# EAGLE design AgnusAdaptor (EAGLE 9.6.2)
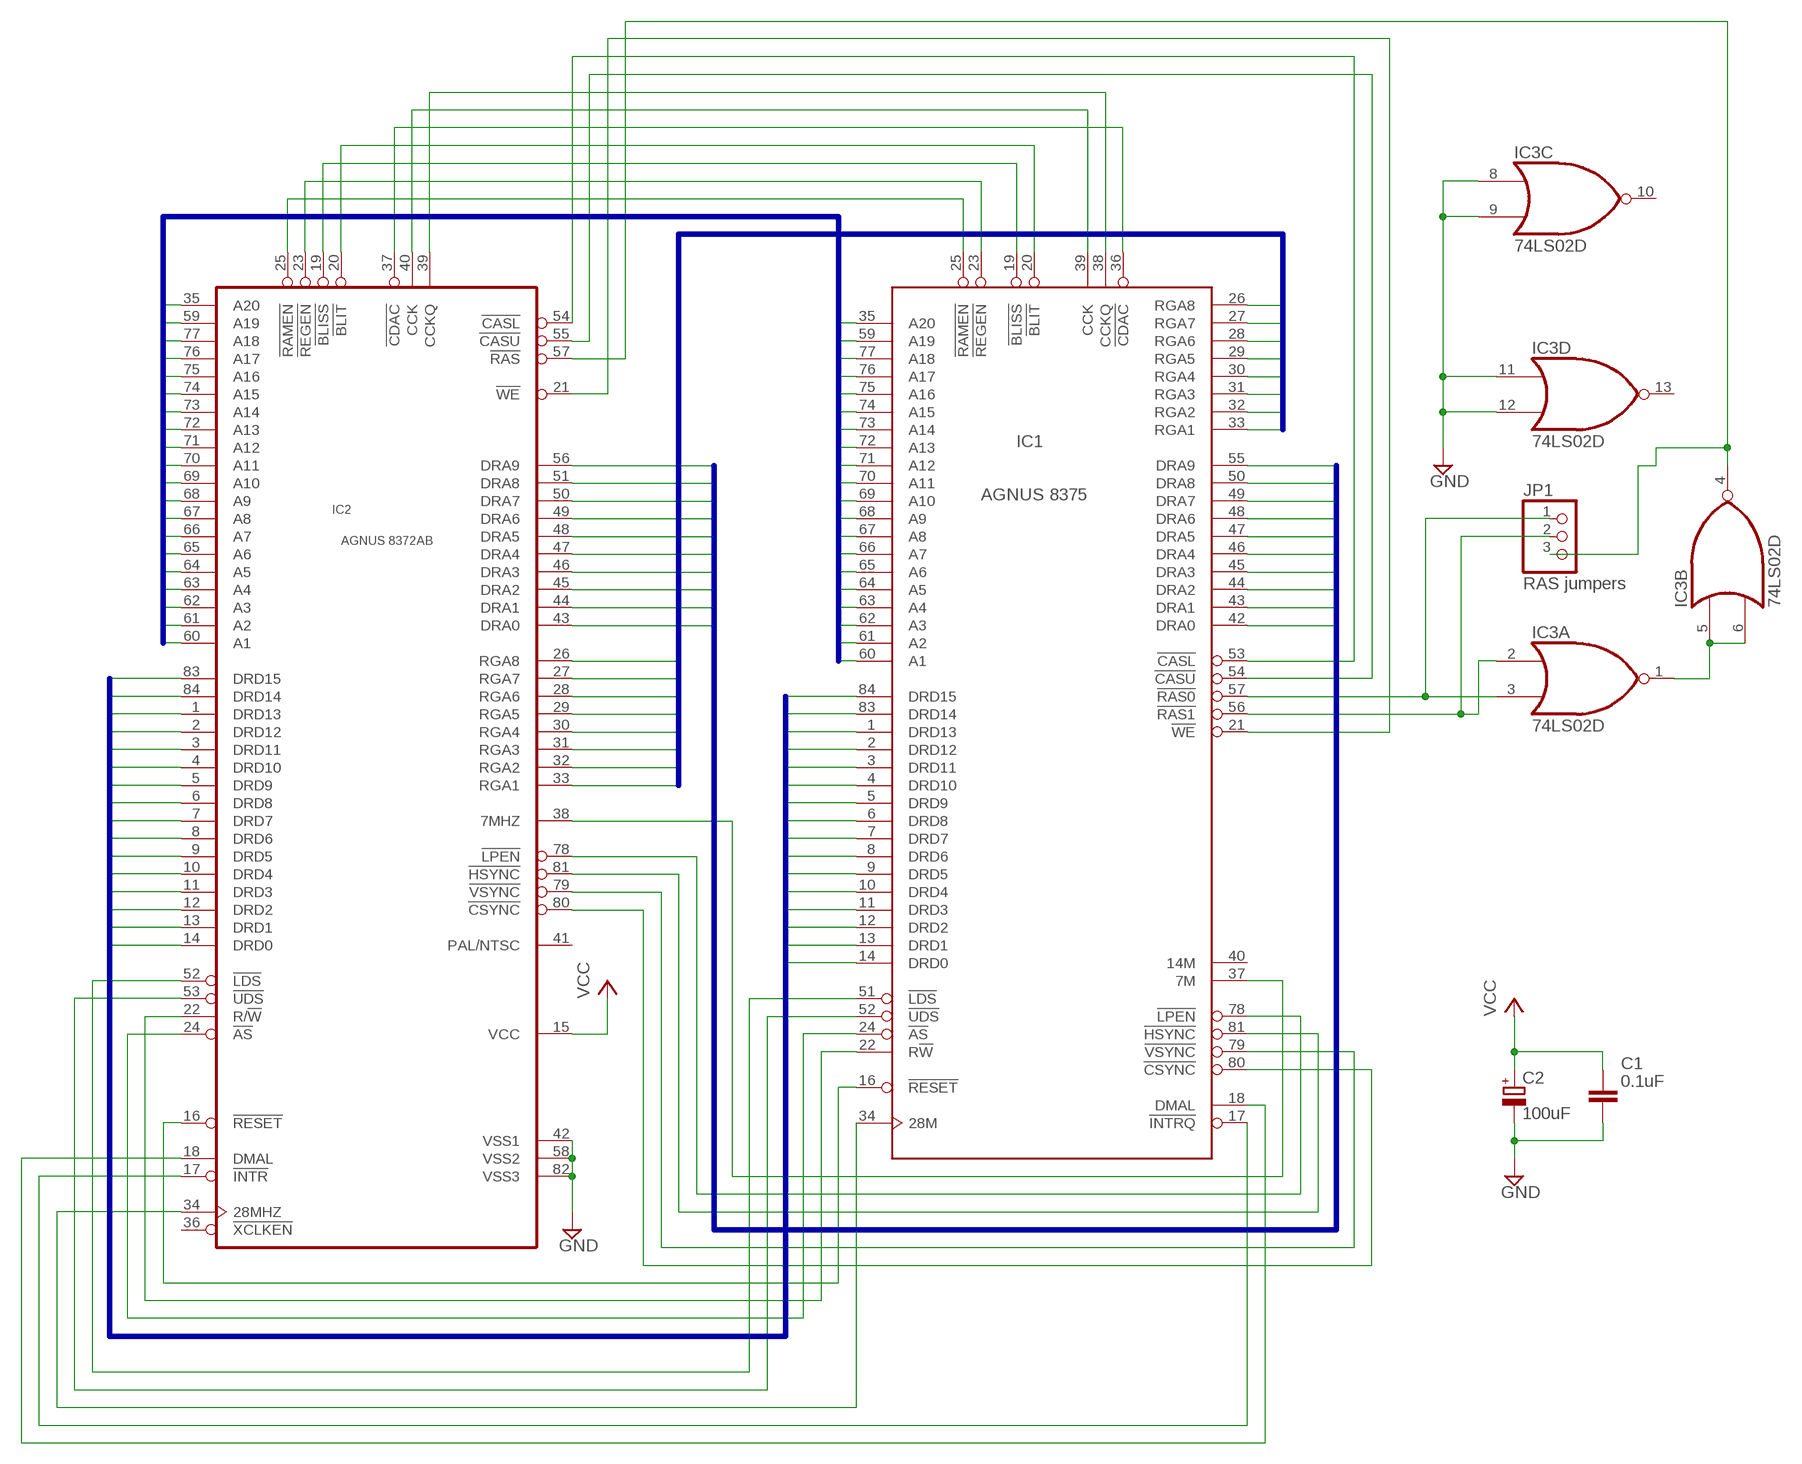
[diagram p0: schematic, sheet 1]

## Parts
C1  0.1uF  C_CHIP-0805(2012-METRIC)  [CAPC2012X110]
C2  100uF  C-POL_ECAP-8.5MM  [CAPAE830X1050N]
IC1  AGNUS_8375_A500+_A600_THT  [PLCC84_T]
IC2  A3000 Agnus Socket  AGNUS_8372AB_THT  [PLCC84_T]
IC3  74LS02D  [SO14]
JP1  RAS jumpers  PINHD-1X3  [1X03]

## Nets
7MHZ: IC1.37(7M) IC2.38(7MHZ)
28MHZ: IC1.34(28M) IC2.34(28MHZ)
!AS: IC1.24(!AS) IC2.24(!AS)
!BLISS: IC1.19(!BLISS) IC2.19(!BLISS)
!BLIT: IC1.20(!BLIT) IC2.20(!BLIT)
!CASL: IC1.53(!CASL) IC2.54(!CASL)
!CASU: IC1.54(!CASU) IC2.55(!CASU)
!CDAC: IC1.36(!CDAC) IC2.37(!CDAC)
!CSYNC: IC1.80(!CSYNC) IC2.80(!CSYNC)
!HSYNC: IC1.81(!HSYNC) IC2.81(!HSYNC)
!INTRQ: IC1.17(!INTRQ) IC2.17(!INTR)
!LDS: IC1.51(!LDS) IC2.52(!LDS)
!LPEN: IC1.78(!LPEN) IC2.78(!LPEN)
!RAMEN: IC1.25(!RAMEN) IC2.25(!RAMEN)
!RAS: IC2.57(!RAS) IC3.4(B:O) JP1.3
!RAS0: IC1.57(!RAS0) IC3.3(A:I1) JP1.1
!RAS1: IC1.56(!RAS1) IC3.2(A:I0) JP1.2
!REGEN: IC1.23(!REGEN) IC2.23(!REGEN)
!RESET: IC1.16(!RESET) IC2.16(!RESET)
!UDS: IC1.52(!UDS) IC2.53(!UDS)
!VSYNC: IC1.79(!VSYNC) IC2.79(!VSYNC)
!WE: IC1.21(!WE) IC2.21(!WE)
A1: IC1.60(A1) IC2.60(A1)
A2: IC1.61(A2) IC2.61(A2)
A3: IC1.62(A3) IC2.62(A3)
A4: IC1.63(A4) IC2.63(A4)
A5: IC1.64(A5) IC2.64(A5)
A6: IC1.65(A6) IC2.65(A6)
A7: IC1.66(A7) IC2.66(A7)
A8: IC1.67(A8) IC2.67(A8)
A9: IC1.68(A9) IC2.68(A9)
A10: IC1.69(A10) IC2.69(A10)
A11: IC1.70(A11) IC2.70(A11)
A12: IC1.71(A12) IC2.71(A12)
A13: IC1.72(A13) IC2.72(A13)
A14: IC1.73(A14) IC2.73(A14)
A15: IC1.74(A15) IC2.74(A15)
A16: IC1.75(A16) IC2.75(A16)
A17: IC1.76(A17) IC2.76(A17)
A18: IC1.77(A18) IC2.77(A18)
A19: IC1.59(A19) IC2.59(A19)
A20: IC1.35(A20) IC2.35(A20)
CCK: IC1.39(CCK) IC2.40(CCK)
CCKQ: IC1.38(CCKQ) IC2.39(CCKQ)
DMAL: IC1.18(DMAL) IC2.18(DMAL)
DRA0: IC1.42(DRA0) IC2.43(DRA0)
DRA1: IC1.43(DRA1) IC2.44(DRA1)
DRA2: IC1.44(DRA2) IC2.45(DRA2)
DRA3: IC1.45(DRA3) IC2.46(DRA3)
DRA4: IC1.46(DRA4) IC2.47(DRA4)
DRA5: IC1.47(DRA5) IC2.48(DRA5)
DRA6: IC1.48(DRA6) IC2.49(DRA6)
DRA7: IC1.49(DRA7) IC2.50(DRA7)
DRA8: IC1.50(DRA8) IC2.51(DRA8)
DRA9: IC1.55(DRA9) IC2.56(DRA9)
DRD0: IC1.14(DRD0) IC2.14(DRD0)
DRD1: IC1.13(DRD1) IC2.13(DRD1)
DRD2: IC1.12(DRD2) IC2.12(DRD2)
DRD3: IC1.11(DRD3) IC2.11(DRD3)
DRD4: IC1.10(DRD4) IC2.10(DRD4)
DRD5: IC1.9(DRD5) IC2.9(DRD5)
DRD6: IC1.8(DRD6) IC2.8(DRD6)
DRD7: IC1.7(DRD7) IC2.7(DRD7)
DRD8: IC1.6(DRD8) IC2.6(DRD8)
DRD9: IC1.5(DRD9) IC2.5(DRD9)
DRD10: IC1.4(DRD10) IC2.4(DRD10)
DRD11: IC1.3(DRD11) IC2.3(DRD11)
DRD12: IC1.2(DRD12) IC2.2(DRD12)
DRD13: IC1.1(DRD13) IC2.1(DRD13)
DRD14: IC1.83(DRD14) IC2.84(DRD14)
DRD15: IC1.84(DRD15) IC2.83(DRD15)
GND: C1.2 C2.2(-) IC2.42(VSS1) IC2.58(VSS2) IC2.82(VSS3) IC3.8(C:I0) IC3.9(C:I1) IC3.11(D:I0) IC3.12(D:I1)
R!W: IC1.22(R!W) IC2.22(R/!W!)
RAS: IC3.1(A:O) IC3.5(B:I0) IC3.6(B:I1)
RGA1: IC1.33(RGA1) IC2.33(RGA1)
RGA2: IC1.32(RGA2) IC2.32(RGA2)
RGA3: IC1.31(RGA3) IC2.31(RGA3)
RGA4: IC1.30(RGA4) IC2.30(RGA4)
RGA5: IC1.29(RGA5) IC2.29(RGA5)
RGA6: IC1.28(RGA6) IC2.28(RGA6)
RGA7: IC1.27(RGA7) IC2.27(RGA7)
RGA8: IC1.26(RGA8) IC2.26(RGA8)
VCC [Vcc]: C1.1 C2.1(+) IC2.15(VCC)
Unconnected: IC1.40(14M) IC2.36(!XCLKEN) IC2.41(PAL/NTSC) IC3.10(C:O) IC3.13(D:O)

## Buses
A[1..20]
DRD[0..15]
RGA[1..8]
DRA[0..9]

## Power pins joined to a net without a drawn wire
GND: IC1.41(GND) IC1.58(GND) IC1.82(GND) IC3.7(P:GND)
VCC: IC1.15(VCC) IC3.14(P:VCC)

## Library data of the parts
C1 = Capacitor:C: Capacitor - Generic; CATEGORY: Capacitor
C2 = Capacitor:C-POL: Capacitor Polarised - Generic; CATEGORY: Capacitor
IC1 = Amiga:AGNUS_8375_A500+_A600: 8375-(390344-0X)-AGNUS for A500+ and A600
IC2 = Amiga:AGNUS_8372AB: 8372AB AGNUS (318069-03x) for A3000(T)
IC3 = 74xx-us:74*02: Quad 2-input NOR gate
JP1 = pinhead:PINHD-1X3: PIN HEADER

## Net classes
1 Vcc: width 0.406 mm

## Board
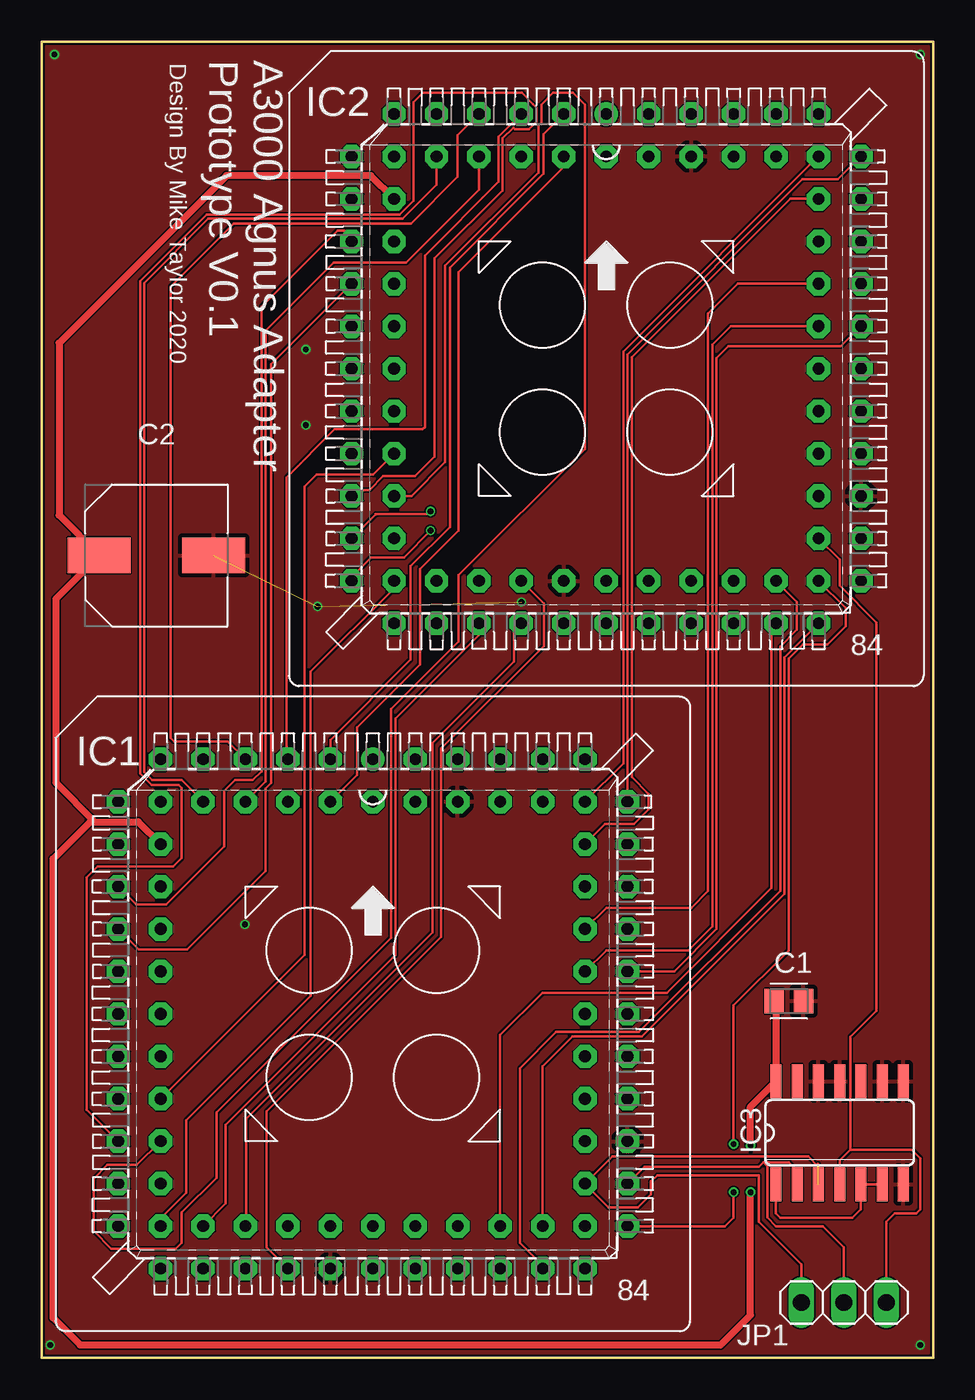
[diagram p1: board, top side]
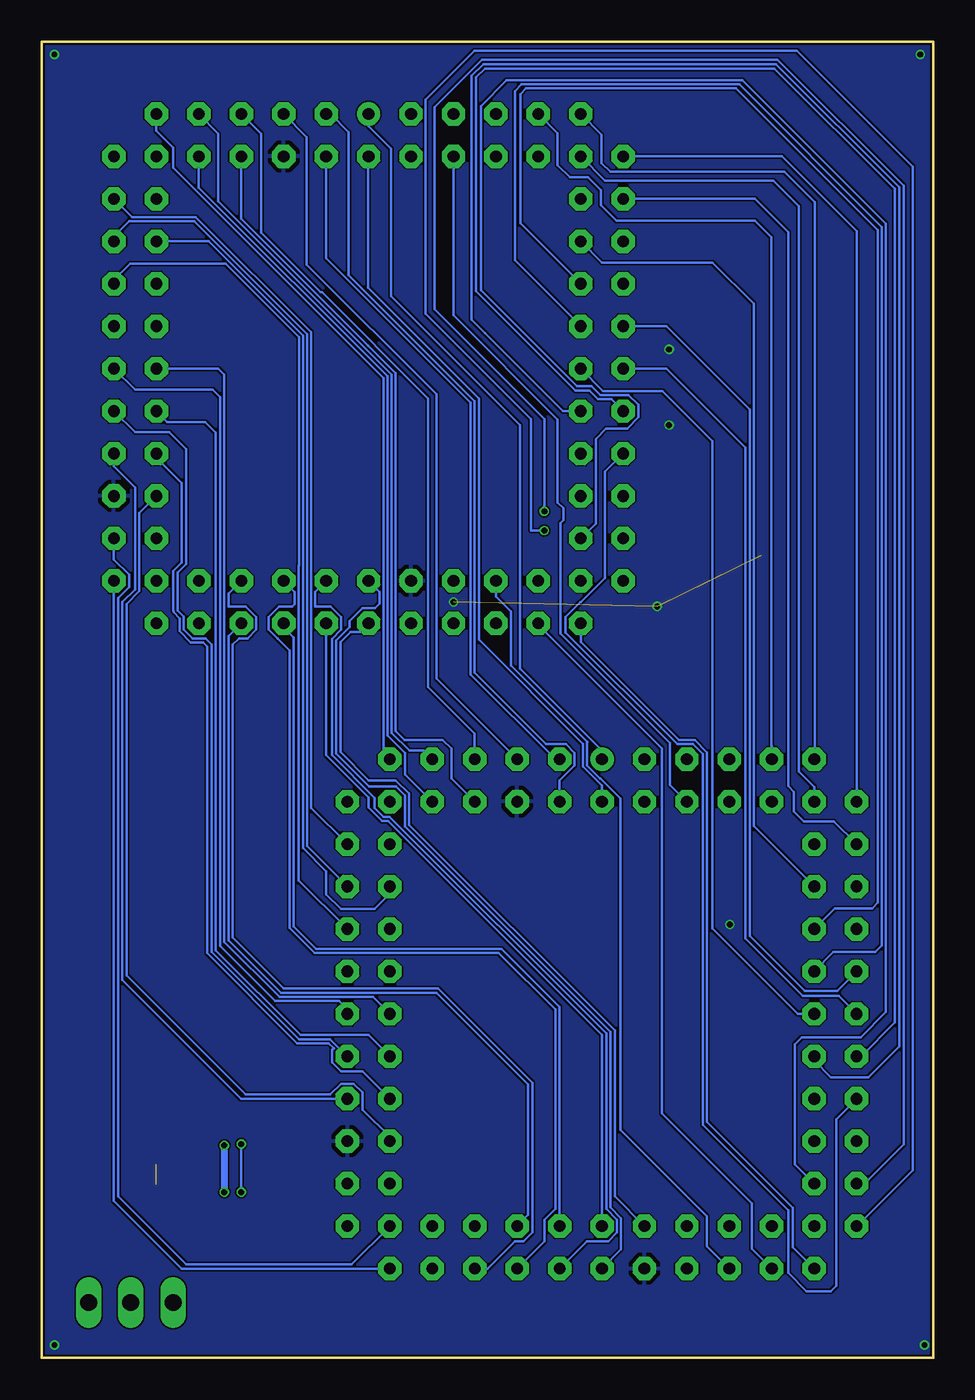
[diagram p2: board, bottom side, seen from below]

Size 53.34 x 78.74 mm. Coordinates in mm from the lower left corner, seen from the top.
Outline: 0,78.74 53.34,78.74 53.34,0 0,0 0,78.74
Copper layers (1*16): Top 0.035mm / dielectric 0.2mm / Bottom 0.035mm
Design rules "jlcpcb-2-layer *": minimum track width 3.5mil, minimum drill 0.2mm, track to track 3.5mil, track to pad 5mil, pad to pad 5mil, via to via 5mil, smd to smd 0mil, copper to edge 0.1mm, drill to drill 5mil, minimum pad ring 4mil, minimum via ring 4mil, stop-mask expansion 3mil, vias tented up to drill 100mil, thermal gap 10mil

### Footprints (pad centres in the part's own frame; a part is rotated, then mirrored left to right if it is on the bottom)
CAPC2012X110 = smd 1.165 x 1.465: 1 -0.875,0; 2 0.875,0
CAPAE830X1050N = smd 3.764 x 2.115: 1 -3.426,0; 2 3.426,0
PLCC84_T = drill 0.7 pad 1.4: 1 0,15.24 | drill 0.7 pad 1.4 octagon: 2 0,12.7; 3 -2.54,15.24; 4 -2.54,12.7; 5 -5.08,15.24; 6 -5.08,12.7; 7 -7.62,15.24; 8 -7.62,12.7; 9 -10.16,15.24; 10 -10.16,12.7; 11 -12.7,15.24; 12 -15.24,12.7; 13 -12.7,12.7; 14 -15.24,10.16; 15 -12.7,10.16; 16 -15.24,7.62; 17 -12.7,7.62; 18 -15.24,5.08; 19 -12.7,5.08; 20 -15.24,2.54; 21 -12.7,2.54; 22 -15.24,0; 23 -12.7,0; 24 -15.24,-2.54; 25 -12.7,-2.54; 26 -15.24,-5.08; 27 -12.7,-5.08; 28 -15.24,-7.62; 29 -12.7,-7.62; 30 -15.24,-10.16; 31 -12.7,-10.16; 32 -15.24,-12.7; 33 -12.7,-15.24; 34 -12.7,-12.7; 35 -10.16,-15.24; 36 -10.16,-12.7; 37 -7.62,-15.24; 38 -7.62,-12.7; 39 -5.08,-15.24; 40 -5.08,-12.7; 41 -2.54,-15.24; 42 -2.54,-12.7; 43 0,-15.24; 44 0,-12.7; 45 2.54,-15.24; 46 2.54,-12.7; 47 5.08,-15.24; 48 5.08,-12.7; 49 7.62,-15.24; 50 7.62,-12.7; 51 10.16,-15.24; 52 10.16,-12.7; 53 12.7,-15.24; 54 15.24,-12.7; 55 12.7,-12.7; 56 15.24,-10.16; 57 12.7,-10.16; 58 15.24,-7.62; 59 12.7,-7.62; 60 15.24,-5.08; 61 12.7,-5.08; 62 15.24,-2.54; 63 12.7,-2.54; 64 15.24,0; 65 12.7,0; 66 15.24,2.54; 67 12.7,2.54; 68 15.24,5.08; 69 12.7,5.08; 70 15.24,7.62; 71 12.7,7.62; 72 15.24,10.16; 73 12.7,10.16; 74 15.24,12.7; 75 12.7,15.24; 76 12.7,12.7; 77 10.16,15.24; 78 10.16,12.7; 79 7.62,15.24; 80 7.62,12.7; 81 5.08,15.24; 82 5.08,12.7; 83 2.54,15.24; 84 2.54,12.7
SO14 = smd 0.66 x 2.032: 1 -3.81,-3.073; 2 -2.54,-3.073; 3 -1.27,-3.073; 4 0,-3.073; 5 1.27,-3.073; 6 2.54,-3.073; 7 3.81,-3.073; 8 3.81,3.073; 9 2.54,3.073; 10 1.27,3.073; 11 0,3.073; 12 -1.27,3.073; 13 -2.54,3.073; 14 -3.81,3.073
1X03 = drill 1.016 long: 1 -2.54,0; 2 0,0; 3 2.54,0

### Placement (x,y rotation side)
C1  44.7,21.34 0 top
C2  6.86,48.01 0 top
IC1  19.81,20.57 0 top
IC2  33.78,59.18 0 top
IC3  47.75,13.46 0 top
JP1  48.01,3.3 0 top

### Tracks (layer width: path | path; a pad name or v marks a point on that pad's centre or on a via)
7MHZ
  Bottom 0.152: IC2.38 26.16,45.54 25.27,44.65 25.27,41.41 20.69,36.83 20.71,36.81 20.71,35.44 19.93,34.66 19.9,34.66 18.72,33.48 18.72,13.64 13.54,8.46 13.54,6.68 IC1.37
28MHZ
  Top 0.152: IC2.34 21.08,46.04 16.09,41.05 16.09,21.64 8.65,14.2 8.65,9.87 7.11,8.33 IC1.34
!AS
  Bottom 0.15: IC2.24 19.25,57.35 20.05,57.35 20.57,57.88 21.41,57.88 27.36,63.83 27.36,76.61 26.82,77.14 9.49,77.14 2.29,69.94 2.29,20.05 4.3,18.03 IC1.24
!BLISS
  Bottom 0.152: IC2.19 24.7,67.88 24.7,75.6 24.35,75.95 11.79,75.95 3.31,67.47 3.31,27.23 3.65,26.9 5.87,26.9 IC1.19
!BLIT
  Bottom 0.152: IC2.20 15.96,61.72 10.97,56.73 10.97,25.25 7.66,21.94 5.74,21.94 IC1.20
!CASL
  Bottom 0.152: IC2.54 49.02,9.4 44.96,5.33 IC1.53
!CASU  (via drill 0.35)
  Top 0.152: IC2.55 48.12,44.84 48.12,43.77 47.02,42.67 45.55,42.67 44.7,41.82 44.7,24.38 41.4,21.08 v41.4,12.79 41.4,12.7 | v41.4,9.91 41.4,8.38 40.89,7.87 IC1.54
  Bottom 0.152: v41.4,12.79 v41.4,9.91
!CDAC
  Top 0.152: IC2.37 26.16,43.23 21.18,38.25 21.18,24.1 11.01,13.93 11.01,9.23 IC1.36
!CSYNC
  Bottom 0.152: IC1.80 28.82,34.66 28.82,36.44 29.34,36.97 31.64,36.97 32.15,37.49 32.15,58.91 33.81,60.57 41.4,68.17 IC2.80
!HSYNC
  Bottom 0.152: IC1.81 29.72,40.64 29.72,57.66 37.48,65.42 37.48,73.04 IC2.81
!INTRQ
  Bottom 0.152: IC2.17 19.81,65.53 13.2,65.53 10.73,63.06 10.73,31.81 IC1.17
!LDS
  Top 0.152: IC2.52 45.2,45.22 45.2,43.57 44.2,42.56 44.2,27.94 35.74,19.48 30.79,19.48 28.62,17.32 28.62,6.88 29.97,5.53 IC1.51
!LPEN
  Bottom 0.152: IC2.78 43.94,70.03 32.64,58.72 32.64,37.22 31.61,36.19 31.61,34.91 IC1.78
!RAMEN
  Bottom 0.15: 27.62,62.12 27.62,76.7 26.91,77.41 9.4,77.41 2.02,70.03 2.02,18.64 3.89,16.78 6.11,16.78 7.11,17.78 IC1.25
  Bottom 0.152: 27.62,62.12 26.82,61.32 22.15,56.64 IC2.25
!RAS
  Top 0.152: 47.75,11.07 IC3.4 47.75,11.81 48.39,12.45 | 48.39,12.45 48.39,19.21 49.95,20.77 49.95,44 47.75,46.19 47.75,47.75 IC2.57 | JP1.3 50.55,8.13 51.05,8.64 52.32,8.64 52.58,8.89 52.58,11.94 52.07,12.45 48.39,12.45
!RAS0  (1 unrouted)
  Top 0.152: 46.48,11.58 46.46,11.61 | IC3.3 46.48,11.43 45.86,12.05 34.15,12.05 IC1.57 33.92,9 35.68,9 36.46,9.79 36.46,10.55 36.83,10.92 42.93,10.92 42.93,8.13 45.47,5.59 JP1.1
!RAS1
  Top 0.152: IC3.2 45.47,10.64 45.47,10.92 44.7,11.68 43.18,11.68 | JP1.2 48.01,6.6 46.74,7.87 43.94,7.87 43.41,8.41 43.41,11.45 43.18,11.68 | IC1.56 36.07,11.43 42.93,11.43 43.18,11.68
!REGEN
  Bottom 0.152: IC2.23 19.75,57.85 16.19,57.85 13.2,54.85 13.2,25.68 8.09,20.57 IC1.23
!RESET
  Top 0.15: 10.92,33.9 11.58,34.56 12.62,34.56 13.15,35.09
  Top 0.152: 13.15,35.09 13.15,62.89 17.71,67.45 18.11,67.45 18.54,67.02 IC2.16 | 10.92,33.9 10.92,30.6 7.45,27.13 5.64,27.13 IC1.16
!UDS
  Top 0.152: IC2.53 44.44,41.9 44.44,27.76 35.9,19.23 31.76,19.23 29.97,17.44 IC1.52
!VSYNC
  Bottom 0.152: IC2.79 40.21,73.23 40.21,67.31 36.65,63.75 36.58,63.75 30.23,57.4 30.23,40.13 27.43,37.34 IC1.79
!WE
  Bottom 0.152: IC2.21 25.03,65.67 25.03,75.78 24.63,76.19 11.6,76.19 3.07,67.66 3.07,24.67 3.47,24.27 5.96,24.27 IC1.21
A1
  Bottom 0.152: IC2.60 49.02,53.34 47.75,52.07 47.75,45.97 48.51,45.21 48.51,22.61 41.4,15.49 IC1.60
A2
  Bottom 0.152: 37.34,18.8 37.36,18.82 | 37.36,18.82 38.05,18.82 43.43,24.21 43.43,42.54 43.69,42.8 44.42,42.8 45.09,43.47 45.09,44.24 45.45,44.6 45.45,44.69 45.47,44.7 45.47,47.08 44.96,47.59 44.96,52.32 46.48,53.85 IC2.61 | 37.36,18.82 36.18,18.82 35.86,18.5 35.95,18.41 35.95,17.66 35.43,17.13 34.15,17.13 IC1.61
A3
  Bottom 0.152: IC2.62 47.75,55.37 45.72,55.37 44.7,54.36 44.7,47.5 45.21,46.99 45.21,44.7 44.84,44.34 44.84,43.57 44.32,43.04 43.55,43.04 43.18,42.67 43.18,24.3 37.95,19.06 36.08,19.06 IC1.62
A4
  Bottom 0.152: IC1.63 33.78,19.3 37.85,19.3 42.93,24.38 42.93,55.36 43.55,55.98 45.82,55.98 IC2.63
A5
  Bottom 0.152: IC2.64 47.76,57.92 43.55,57.92 43.54,57.94 43.1,57.94 42.66,57.49 42.66,47.77 42.67,47.75 42.67,24.64 39.37,21.34 35.56,21.34 35.05,20.83 IC1.64
A6
  Bottom 0.152: IC1.65 33.53,21.59 39.12,21.59 42.42,24.89 42.42,58.83 42.77,59.18 IC2.65
A7
  Top 0.152: IC1.66 37.85,23.11 40.39,25.65 40.39,59.8 41.1,60.52 47.82,60.52 IC2.66
A8
  Top 0.152: IC1.67 33.78,24.38 38.7,24.38 40.13,25.82 40.13,60.6 41.25,61.72 IC2.67
A9
  Bottom 0.152: IC1.68 37.96,28.56 37.96,47.39 37.95,47.39 37.95,61.06 42.35,65.45 48.05,65.45 49.02,64.48 IC2.68
A10
  Top 0.152: IC2.69 41.66,64.26 39.88,62.48 39.88,27.94 38.86,26.92 33.78,26.92 IC1.69
A11
  Bottom 0.152: IC2.70 49.02,67.08 48.11,68 44.21,68 37.47,61.26 37.47,30.61 IC1.70
A12
  Bottom 0.152: IC2.71 43.35,66.8 37.71,61.16 37.71,30.51 36.31,29.11 36.31,27.73 35.43,26.85 33.43,26.85 32.51,27.77 IC1.71
A13
  Bottom 0.152: IC2.72 47.93,68.25 44.12,68.25 37.22,61.36 37.22,32.91 IC1.72
A14
  Top 0.152: IC2.73 44.79,69.34 35.31,59.86 35.31,34.74 36.31,33.74 36.31,32.81 35.43,31.93 33.7,31.93 IC1.73
A15
  Top 0.152: IC2.74 47.65,70.51 45.53,70.51 35.05,60.03 IC1.74
A16
  Bottom 0.152: IC2.75 46.48,73.41 45.47,72.39 45.47,71.21 32.88,58.62 32.88,36.18 IC1.75
A17
  Top 0.152: IC2.76 34.8,60.2 34.8,35.56 IC1.76
A18
  Bottom 0.152: IC2.77 42.77,73.25 42.77,69.2 32.4,58.82 32.4,37.39 31.33,36.32 30.48,36.32 IC1.77
A19
  Bottom 0.152: IC2.59 47.51,50.53 47.51,45.87 48.27,45.11 48.27,22.87 41.15,15.75 36.07,15.75 35.43,16.4 34.68,16.4 34.15,15.87 34.15,14.85 32.51,13.21 IC1.59
A20
  Bottom 0.152: IC2.35 23.62,43.85 16.23,36.46 16.23,14.61 10.85,9.23 10.85,6.53 IC1.35
CCK
  Top 0.152: IC2.40 30.05,45.13 30.05,42.59 23.9,36.44 23.9,25.19 13.45,14.74 13.45,6.62 IC1.39
CCKQ
  Top 0.152: IC2.39 28.26,43.5 28.26,41.66 23.39,36.79 23.39,25.46 12.22,14.29 12.22,7.9 IC1.38
DMAL
  Top 0.152: IC2.18 13.72,59.44 13.72,34.38 13.4,34.06 13.4,30.56 13.4,30.54 13.4,29.13 8.69,24.42 5.8,24.42 IC1.18
DRA0
  Bottom 0.152: IC2.43 34.29,43.43 34.87,43.43 35.47,42.83 35.47,36.24 33.77,34.54 32.16,34.54 31.37,33.75 31.37,31.89 19.05,19.57 19.05,9.65 IC1.42
DRA1
  Bottom 0.152: IC1.43 18.67,6.48 18.67,8.35 19.3,8.98 19.3,19.49 31.61,31.79 31.61,33.65 32.14,34.18 33.75,34.18 35.73,36.16 35.73,42.92 34.92,43.72 34.92,44.08 34.16,44.84 33.41,44.84 33.12,45.13 33.12,45.82 33.27,45.97 33.65,46.36 IC2.44
DRA2
  Bottom 0.152: IC2.45 36.32,36.07 33.78,33.53 33.78,32.92 32.99,32.13 32.63,32.13 19.81,19.31 IC1.44
DRA3
  Bottom 0.152: IC1.45 20.71,6.97 19.44,6.97 18.91,7.5 18.91,8.25 19.56,8.9 19.56,19.4 32.53,32.37 32.89,32.37 33.41,32.9 33.41,33.5 35.97,36.05 35.97,43.02 35.42,43.57 35.42,44.2 35.42,44.32 36.06,44.96 36.98,44.96 36.98,45.82 IC2.46
DRA4
  Bottom 0.152: IC2.47 38.86,43.69 38.26,43.09 38.26,25.82 36.92,24.47 25.82,24.47 22.35,21 IC1.46
DRA5
  Bottom 0.152: IC1.47 23.25,6.97 23.25,8.25 22.61,8.9 22.61,20.83 26.01,24.23 37.02,24.23 38.51,25.72 38.51,42.32 39.23,43.04 39.24,43.04 39.76,43.57 39.76,44.32 39.12,44.96 38.35,44.96 38.2,45.11 38.2,45.82 IC2.48
DRA6
  Bottom 0.152: IC2.49 42.16,43.18 42.16,24.98 39.03,21.84 29.72,21.84 24.23,16.36 24.23,8.54 IC1.48
DRA7
  Bottom 0.152: IC1.49 26.67,5.33 25.03,6.97 24.52,6.97 23.99,7.5 23.99,16.46 29.63,22.1 38.86,22.1 41.91,25.15 41.91,42.67 41.54,43.04 41.03,43.04 40.5,43.57 40.5,44.32 41.14,44.96 42.16,44.96 42.16,45.72 IC2.50
DRA8
  Top 0.152: IC2.51 43.67,43.67 43.67,28.11 37.41,21.84 29.97,21.84 27.43,19.3 IC1.50
DRA9
  Bottom 0.152: IC2.56 49.02,47.76 48.12,46.86 48.12,46.11 48.77,45.46 48.77,9.65 44.7,5.59 34.8,5.59 IC1.55
DRD0
  Bottom 0.152: IC2.14 10.66,69.34 8.67,67.35 8.67,34.2 8.33,33.86 8.33,32.68 7.74,32.09 5.93,32.09 IC1.14
DRD1
  Bottom 0.152: IC2.13 19.63,70.43 9.56,70.43 8.03,68.91 8.03,35.08 7.11,34.16 IC1.13
DRD2
  Bottom 0.152: IC2.12 9.04,71.88 4.57,67.41 IC1.12
DRD3
  Bottom 0.152: IC2.11 19.84,73.18 19.84,71.49 19.3,70.95 8.9,70.95 7.09,69.14 7.09,35.84 IC1.11
DRD4
  Top 0.15: 6.12,35.05 6.62,34.56 8.37,34.56 IC1.10
  Top 0.152: IC2.10 23.62,70.19 21.58,68.15 9.96,68.15 6.12,64.31 6.12,35.05
DRD5
  Bottom 0.152: IC2.9 22.47,73.27 22.47,71.37 21.72,70.62 20.66,70.62 19.89,69.85 19.89,68.96 18.96,68.03 10.67,68.03 9.68,67.04 9.68,36.59 9.65,36.61 IC1.9
DRD6
  Top 0.152: IC2.8 26.16,69.89 21.8,65.53 17.47,65.53 13.4,61.47 13.4,34.49 IC1.8
DRD7
  Top 0.152: IC2.7 24.89,73.15 24.89,70.68 22.08,67.87 11.49,67.87 7.72,64.1 7.72,37.09 7.93,36.88 11.12,36.88 IC1.7
DRD8
  Bottom 0.152: IC2.6 28.7,62.37 22.47,56.13 22.47,51.18 22.11,50.83 22.11,50.11 22.29,49.94 22.29,43.32 15.74,36.77 15.74,34.28 IC1.6
DRD9
  Top 0.152: IC2.5 27.34,73.06 27.34,70.36 22.92,65.94 22.92,55.7 22.78,55.55 17.52,55.55 14.64,52.67 14.64,35.9 IC1.5
DRD10
  Top 0.152: IC2.4 31.24,71.26 24.93,64.95 24.93,49.49 22.63,47.19 22.63,41.48 18.87,37.72 18.87,34.87 IC1.4
DRD11
  Top 0.152: IC2.3 30.03,73.21 30.03,70.85 24.42,65.24 24.42,49.71 22.07,47.37 22.07,41.77 17.27,36.97 IC1.3
DRD12
  Bottom 0.152: IC1.2 19.81,34.25 20.94,35.38 20.94,36.73 27.18,42.97 27.18,57.4 33.81,64.04 33.81,71.88 IC2.2
DRD13
  Bottom 0.152: IC2.1 33.78,73.69 32.43,72.34 32.43,63.52 24.73,55.82 24.73,41.24 19.81,36.32 IC1.1
DRD14
  Bottom 0.152: IC1.83 22.61,35.81 27.69,40.89 27.69,57.15 36.32,65.79 IC2.84
DRD15
  Bottom 0.152: IC2.83 36.05,74.42 34.97,73.34 34.97,64.78 27.45,57.25 27.45,40.99 23.17,36.72 21.98,36.72 21.45,36.19 21.45,35.44 22.35,34.54 IC1.84
GND  (via drill 0.35)  (2 unrouted)
  other vias: 52.58,0.76 0.51,0.76 0.76,77.98 52.58,77.98 28.7,45.21 12.15,25.93 15.8,60.34 15.8,55.8 16.51,44.96
  pour Top: 0.25,78.49 0.25,0.25 53.09,0.25 53.09,78.49
  pour Bottom: 0.25,78.49 53.09,78.49 53.09,0.25 0.25,0.25
  pour Bottom: 27.94,45.97 28.19,45.72 29.21,45.72 29.46,45.97 29.46,44.45 29.21,44.7 27.94,44.45
R!W
  Bottom 0.152: IC2.22 15.96,59.18 11.24,54.46 11.24,25.08 7.8,21.64 5.64,21.64 IC1.22
RAS
  Top 0.152: IC3.1 43.94,8.64 44.2,8.38 48.51,8.38 49.02,8.89 IC3.5 IC3.6
RGA1
  Bottom 0.152: IC2.33 21.08,42.83 15.21,36.96 14.26,36.96 13.53,36.22 13.53,14.11 8.38,8.96 8.38,6.6 IC1.33
RGA2  (via drill 0.35)
  Top 0.152: IC2.32 18.54,46.72 19.71,47.89 21.67,47.89 v23.27,49.49
  Bottom 0.152: IC1.32 1.22,11.23 1.22,71.27 8.15,78.21 27.45,78.21 30.38,75.27 30.38,62.47 24.07,56.16 24.07,49.49 v23.27,49.49
RGA3
  Bottom 0.152: IC2.31 20.19,49.92 20.19,54.98 19.56,55.6 18.3,55.6 17.64,56.27 17.64,57.02 18.22,57.59 19.89,57.59 20.43,58.13 21.31,58.13 27.07,63.89 27.07,74.89 25.52,76.43 11.41,76.43 2.83,67.85 2.83,20.68 4.33,19.18 7.86,19.18 8.28,18.76 8.28,11.58 IC1.31
RGA4  (via drill 0.35)
  Top 0.152: IC2.30 19.98,50.46 19.98,50.47 23.27,50.47 v23.27,50.65
  Bottom 0.152: IC1.30 4.12,10.41 1.75,12.78 1.75,70.12 9.31,77.67 27,77.67 29.84,74.83 29.84,62.74 23.27,56.16 v23.27,50.65
RGA5
  Top 0.152: IC2.29 22.12,51.56 24.15,53.59 24.15,65.34 29.72,70.91 29.72,73.73 29.91,73.93 29.91,74.99 30.6,75.68 31.79,75.68 32.5,74.97 32.5,54.38 24.95,46.83 24.95,42.87 20.89,38.8 20.89,25.12 10.45,14.69 10.45,10.77 8.38,8.7 8.38,6.89 8.02,6.53 4.16,6.53 3.1,7.59 3.1,10.72 3.91,11.53 5.69,11.53 IC1.29
RGA6
  Top 0.152: IC2.28 18.9,51.92 19.61,51.92 20.44,52.74 22.33,52.74 23.52,53.93 23.52,65.78 27.56,69.83 27.56,70.23 27.58,70.26 27.58,72.96 28.23,73.61 28.33,73.52 29.16,73.52 29.61,73.96 29.61,74.8 29.4,75 29.4,75.01 28.73,75.68 22.8,75.68 22.26,75.14 22.26,69.24 21.41,68.39 9.87,68.39 5.88,64.41 5.88,34.95 6.57,34.27 8.2,34.27 8.37,34.09 8.37,29.92 7.85,29.39 3.34,29.39 2.69,28.75 2.69,14.83 IC1.28
RGA7
  Top 0.152: IC2.27 19.84,52.86 16.46,52.86 15.72,52.12 15.72,24.1 IC1.27
RGA8
  Bottom 0.152: IC2.26 19.63,53.01 19.63,46.65 21.07,45.21 21.09,45.21 21.98,44.32 21.98,43.39 15.31,36.72 14.36,36.72 13.77,36.12 13.77,13.93 8.67,8.83 8.67,5.08 7.58,3.99 6.12,3.99 5.8,4.3 5.8,14.26 IC1.26
VCC  (via drill 0.35)
  Top 0.406: C1.1 43.94,21.22 IC3.14 42.42,15.01 v42.42,12.7 | IC1.15 5.78,32.07 3.18,32.07 | v42.42,9.91 42.42,2.54 40.64,0.76 2.29,0.76 0.67,2.38 0.67,29.85 2.9,32.07 3.18,32.07 | IC2.15 19.68,70.74 11.05,70.74 1.03,60.72 1.03,50.41 C2.1 0.84,45.41 0.84,34.41 3.18,32.07
  Bottom 0.406: v42.42,12.7 v42.42,9.91

### Text on the board
_tsilk: Design By Mike Taylor 2020 | A3000 Agnus Adapter / Prototype V0.1